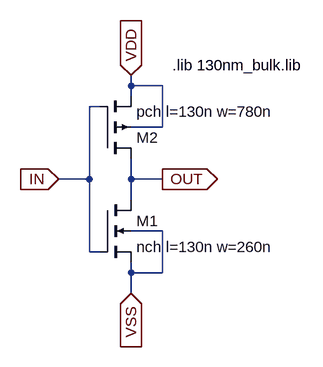
[diagram p0: schematic INVERTER.asc]
INVERTER.asc, the LTspice schematic file:
Version 4.1
SHEET 1 880 680
WIRE 256 -16 256 -32
WIRE 304 -16 256 -16
WIRE 256 0 256 -16
WIRE 208 16 192 16
WIRE 304 48 304 -16
WIRE 304 48 256 48
WIRE 192 128 192 16
WIRE 192 128 144 128
WIRE 256 128 256 96
WIRE 304 128 256 128
WIRE 256 160 256 128
WIRE 304 208 256 208
WIRE 192 240 192 128
WIRE 208 240 192 240
WIRE 256 272 256 256
WIRE 304 272 304 208
WIRE 304 272 256 272
WIRE 256 304 256 272
FLAG 144 128 IN
IOPIN 144 128 In
FLAG 256 -32 VDD
IOPIN 256 -32 In
FLAG 256 304 VSS
IOPIN 256 304 In
FLAG 304 128 OUT
IOPIN 304 128 Out
SYMBOL lib\\lib\\sym\\nmos4 208 160 R0
SYMATTR InstName M1
SYMATTR Value nch l=130n w=260n
SYMBOL lib\\lib\\sym\\pmos4 208 96 M180
SYMATTR InstName M2
SYMATTR Value pch l=130n w=780n
TEXT 320 -48 Left 2 !.lib 130nm_bulk.lib

The netlist it stands for:
* INVERTER.asc
M1 OUT IN VSS VSS nch l=130n w=260n
M2 OUT IN VDD VDD pch l=130n w=780n
.model NMOS NMOS
.model PMOS PMOS
.lib standard.mos
.lib 130nm_bulk.lib
.backanno
.end